# EAGLE schematic TorqueDroid (EAGLE 8.4.3)
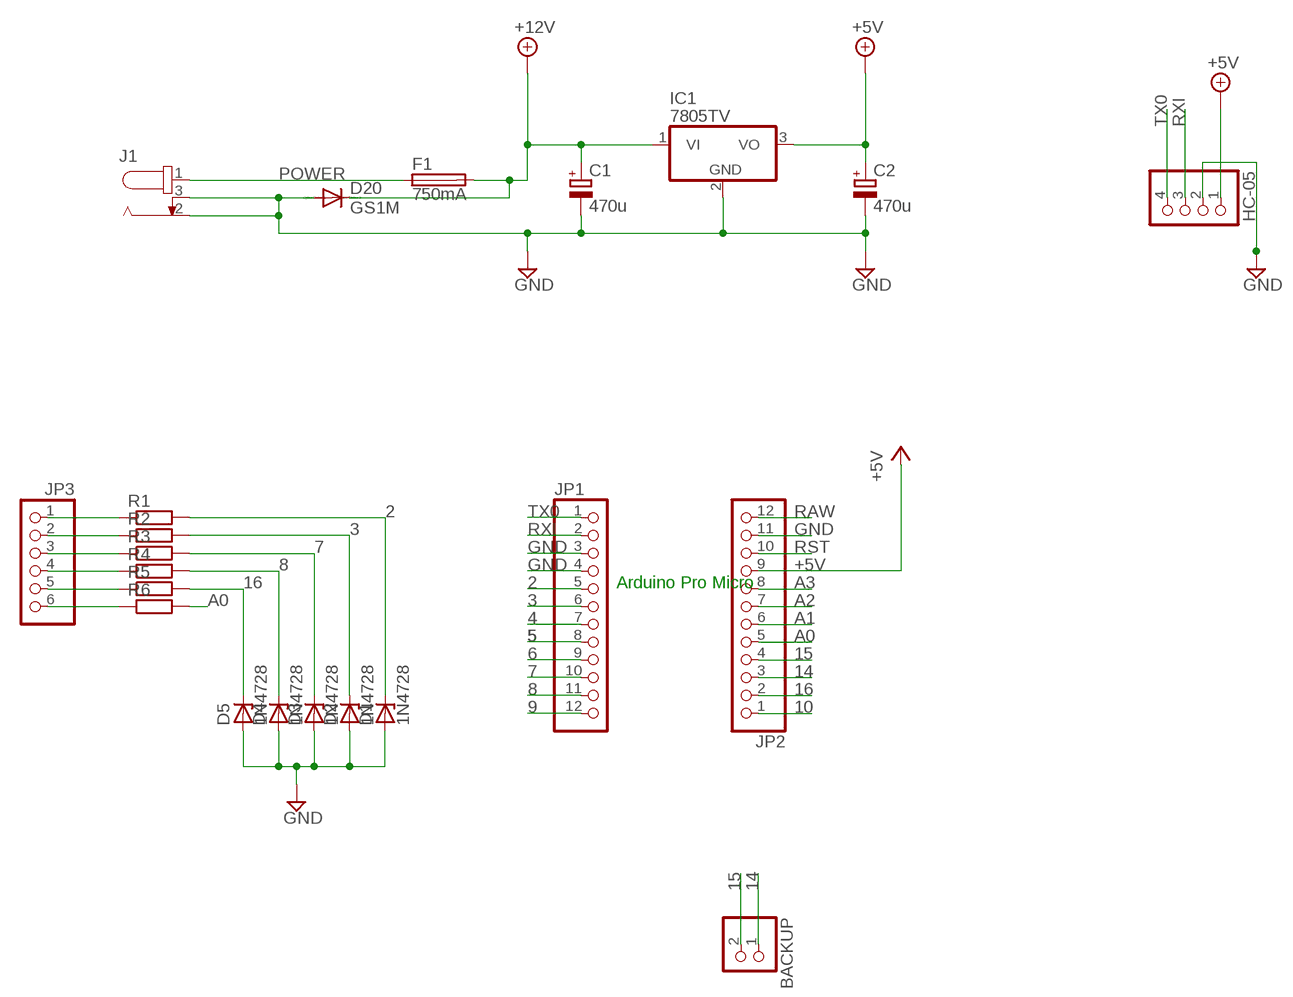
[diagram p0: schematic, sheet 1]

## Parts
BACKUP  PINHD-1X2  [1X02]
C1  470u  CPOL-EUE3.5-10  [E3,5-10]
C2  470u  CPOL-EUE3.5-10  [E3,5-10]
D1  1N4728  [DO41Z10]
D2  1N4728  [DO41Z10]
D3  1N4728  [DO41Z10]
D4  1N4728  [DO41Z10]
D5  1N4728  [DO41Z10]
D20  GS1M  S1M  [SMA]
F1  750mA  MF-SMDF150  [MF-SMDF050]
HC-05  PINHD-1X4  [1X04]
IC1  7805TV  [TO220V]
J1  694102303002  [69410X303002]
JP1  PINHD-1X12  [1X12]
JP2  PINHD-1X12  [1X12]
JP3  PINHD-1X6/90  [1X06/90]
R1  R-EU_R0805  [R0805]
R2  R-EU_R0805  [R0805]
R3  R-EU_R0805  [R0805]
R4  R-EU_R0805  [R0805]
R5  R-EU_R0805  [R0805]
R6  R-EU_R0805  [R0805]

## Nets
2: D1.C JP1.5 R1.2
3: D2.C JP1.6 R2.2
4: JP1.7
5: JP1.8
6: JP1.9
7: D3.C JP1.10 R3.2
8: D4.C JP1.11 R4.2
9: JP1.12
10: JP2.1
14: BACKUP.1 JP2.3
15: BACKUP.2 JP2.4
16: D5.C JP2.2 R5.2
+5V: C2.+ HC-05.1 IC1.3(VO) JP2.9
+9V: C1.+ D20.C F1.2 IC1.1(VI) ; supply symbol labelled +12V
A0: JP2.5 R6.2
A1: JP2.6
A2: JP2.7
A3: JP2.8
GND: C1.- C2.- D1.A D2.A D3.A D4.A D5.A D20.A HC-05.2 IC1.2(GND) J1.2 J1.3 JP1.3 JP1.4 JP2.11
N$1: JP3.1 R1.1
N$2: JP3.2 R2.1
N$3: JP3.3 R3.1
N$4: JP3.4 R4.1
N$5: JP3.5 R5.1
N$6: JP3.6 R6.1
POWER: F1.1 J1.1
RAW: JP2.12
RST: JP2.10
RXI: HC-05.3 JP1.2
TX0: HC-05.4 JP1.1

## Notes on the sheet
- Arduino Pro Micro

## Library data of the parts
BACKUP = pinhead:PINHD-1X2: PIN HEADER
C1 C2 = rcl:CPOL-EU: POLARIZED CAPACITOR, European symbol
D1-D5 = diode:1N4728: Z DIODE 3.3 V, 1W, 5 percent
D20 = diode:S1M
F1 = fuse:MF-SMDF: MF-SMDF Series - PRC Resettable Fuses Source: http://www.farnell.com/datasheets/716597.pdf
HC-05 = pinhead:PINHD-1X4: PIN HEADER
IC1 = linear:78*: Positive VOLTAGE REGULATOR Source: http://cache.national.com/ds/LM/LM78L05.pdf http://www.fairchildsemi.com/ds/LM/LM7805.pdf
J1 = Wurth_Elektronik_Electromechanic_DC_Power_Jack_Connectors_rev16b:694102303002: WR-DC_DC Power Jack_Right Angled_THT Center Pin Ø1.0_Plug ID Ø1.05_Plug OD Ø3.5 ;=>Code : Con_WR-DC_THT_6941xx303002_694102303002 <http://katalog.we-online.de/media/images/eican/Con_WR-DC_THT_6941xx303002_pf2.jpg> Details see: http://katalog.we-online.de/em/datasheet/6941xx303002.pdf Created 2014-10-08, Karrer Zheng 2014 (C) Wurth Elektronik
JP1 JP2 = pinhead1:PINHD-1X12: PIN HEADER
JP3 = pinhead:PINHD-1X6: PIN HEADER
R1-R6 = rcl:R-EU_: RESISTOR, European symbol

## Net classes
0 default: width 0.762 mm, drill 0.254 mm, clearance 0.127 mm